# EAGLE design W020B (EAGLE 6.6.0)
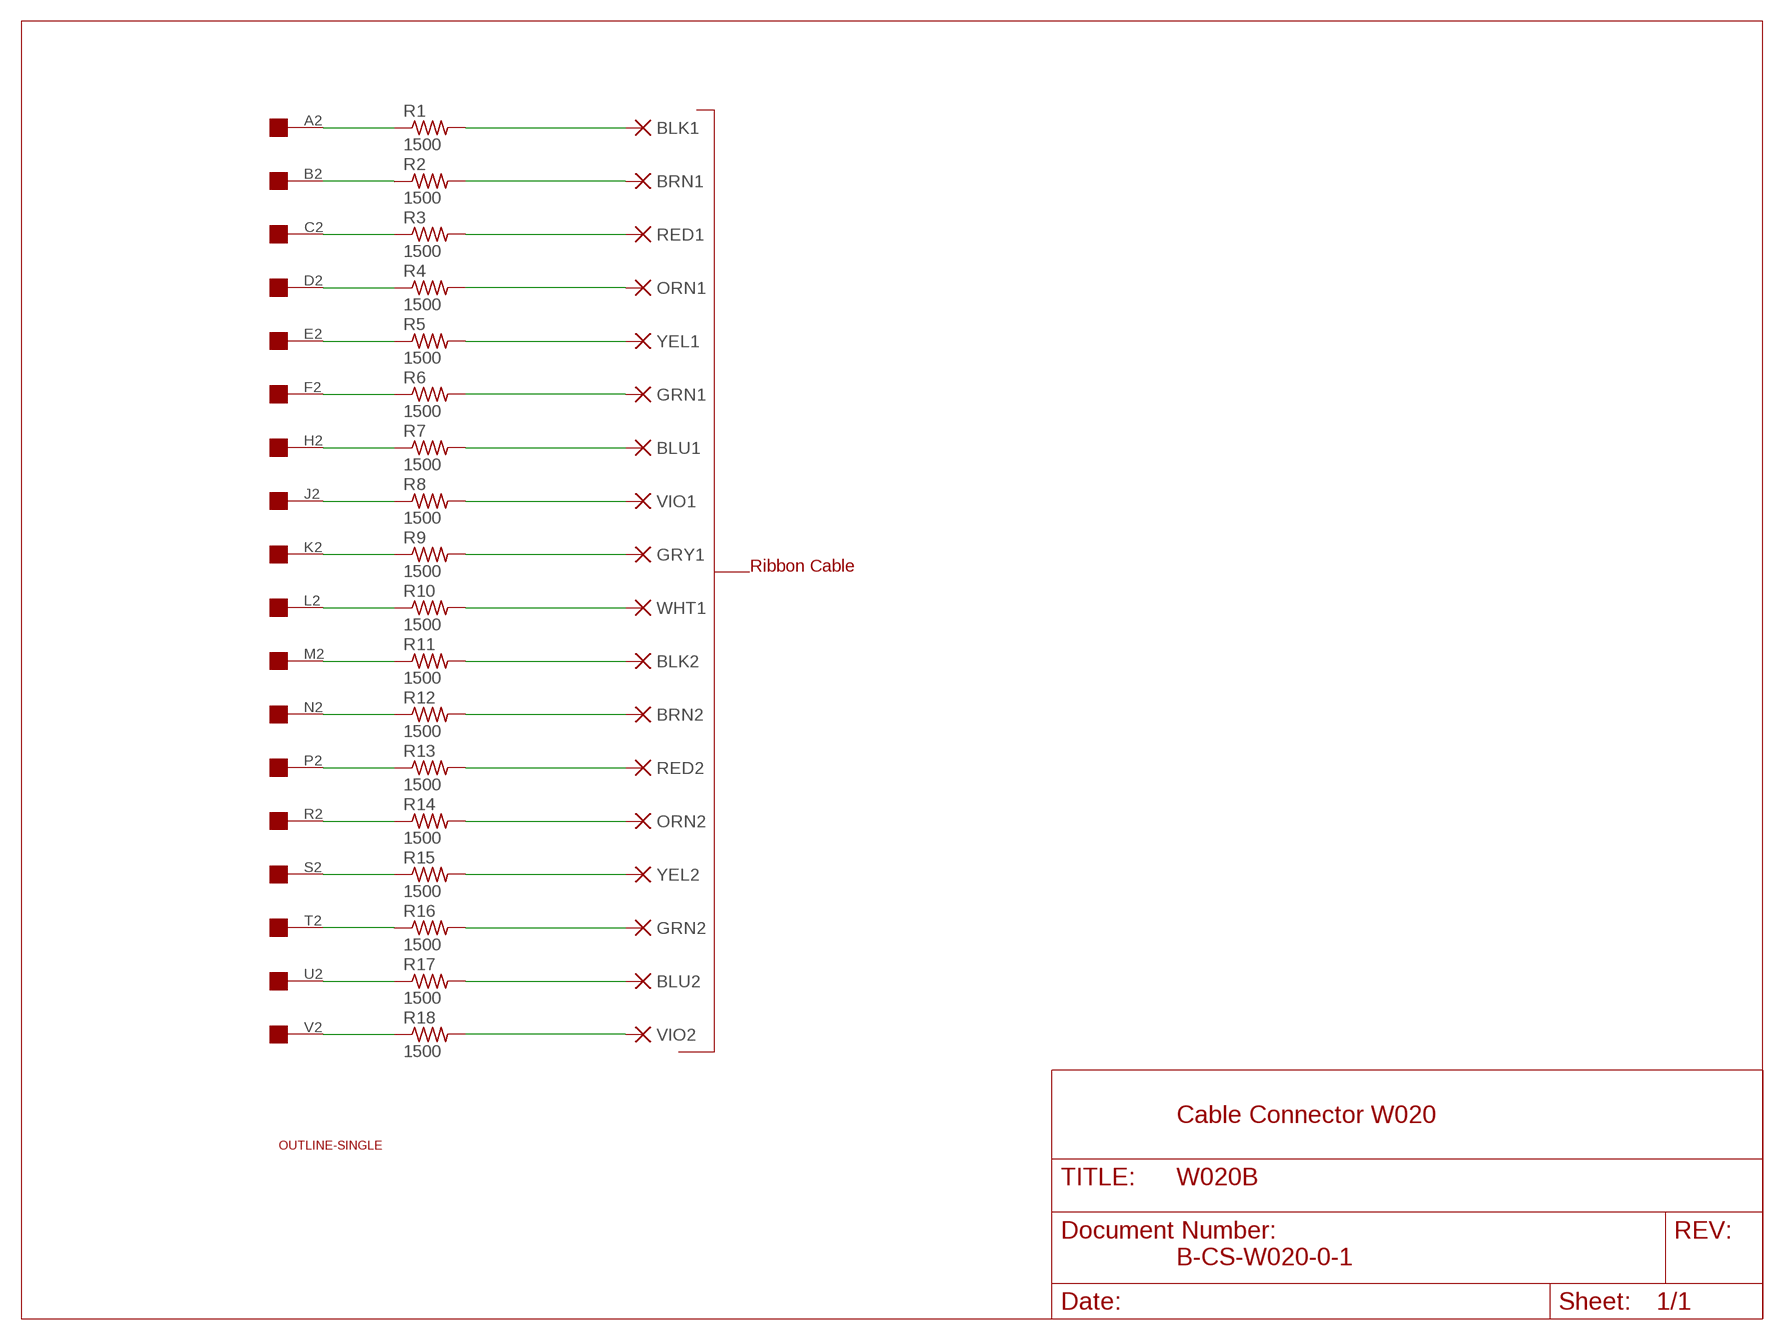
[diagram p0: schematic, sheet 1]

## Parts
BLK1  PAD-0465  [0465]
BLK2  PAD-0465  [0465]
BLU1  PAD-0465  [0465]
BLU2  PAD-0465  [0465]
BRN1  PAD-0465  [0465]
BRN2  PAD-0465  [0465]
GRN1  PAD-0465  [0465]
GRN2  PAD-0465  [0465]
GRY1  PAD-0465  [0465]
ORN1  PAD-0465  [0465]
ORN2  PAD-0465  [0465]
R1  1500  R-US_0207/10  [0207/10]
R2  1500  R-US_0207/10  [0207/10]
R3  1500  R-US_0207/10  [0207/10]
R4  1500  R-US_0207/10  [0207/10]
R5  1500  R-US_0207/10  [0207/10]
R6  1500  R-US_0207/10  [0207/10]
R7  1500  R-US_0207/10  [0207/10]
R8  1500  R-US_0207/10  [0207/10]
R9  1500  R-US_0207/10  [0207/10]
R10  1500  R-US_0207/10  [0207/10]
R11  1500  R-US_0207/10  [0207/10]
R12  1500  R-US_0207/10  [0207/10]
R13  1500  R-US_0207/10  [0207/10]
R14  1500  R-US_0207/10  [0207/10]
R15  1500  R-US_0207/10  [0207/10]
R16  1500  R-US_0207/10  [0207/10]
R17  1500  R-US_0207/10  [0207/10]
R18  1500  R-US_0207/10  [0207/10]
RED1  PAD-0465  [0465]
RED2  PAD-0465  [0465]
U$1  OUTLINE-SINGLE  [SINGLE]
U$2  EDGE-1  [EDGE-CON1]
VIO1  PAD-0465  [0465]
VIO2  PAD-0465  [0465]
WHT1  PAD-0465  [0465]
YEL1  PAD-0465  [0465]
YEL2  PAD-0465  [0465]

## Nets
A2: R1.1 U$2.A2
B2: R2.1 U$2.B2
C2: R3.1 U$2.C2
D2: R4.1 U$2.D2
E2: R5.1 U$2.E2
F2: R6.1 U$2.F2
H2: R7.1 U$2.H2
J2: R8.1 U$2.J2
K2: R9.1 U$2.K2
L2: R10.1 U$2.L2
M2: R11.1 U$2.M2
N2: R12.1 U$2.N2
N$1 [Supply]: ORN1.P$1(P) R4.2
N$2 [Supply]: GRN1.P$1(P) R6.2
N$3 [Supply]: R8.2 VIO1.P$1(P)
N$4 [Supply]: R10.2 WHT1.P$1(P)
N$5 [Supply]: BRN2.P$1(P) R12.2
N$6 [Supply]: ORN2.P$1(P) R14.2
N$7 [Supply]: GRN2.P$1(P) R16.2
N$8 [Supply]: R18.2 VIO2.P$1(P)
N$9: BRN1.P$1(P) R2.2
N$10 [Supply]: R5.2 YEL1.P$1(P)
N$11: BLK1.P$1(P) R1.2
N$12: R3.2 RED1.P$1(P)
N$13: BLU1.P$1(P) R7.2
N$14: GRY1.P$1(P) R9.2
N$15: R13.2 RED2.P$1(P)
N$16: R15.2 YEL2.P$1(P)
N$17: BLU2.P$1(P) R17.2
N$18: BLK2.P$1(P) R11.2
P2: R13.1 U$2.P2
R2: R14.1 U$2.R2
S2: R15.1 U$2.S2
T2: R16.1 U$2.T2
U2: R17.1 U$2.U2
V2: R18.1 U$2.V2

## Notes on the sheet
- Ribbon Cable
- Cable Connector W020
- B-CS-W020-0-1

## Library data of the parts
BLK1 BLK2 BLU1 BLU2 BRN1 BRN2 GRN1 GRN2 GRY1 ORN1 ORN2 RED1 RED2 VIO1 VIO2 WHT1 YEL1 YEL2 = dec-con:PAD: WIRE PAD Standard US Drill Sizes
R1-R18 = rcl:R-US_: RESISTOR, American symbol
U$1 = dec-con:OUTLINE-*: Board outlines for DEC boards.
U$2 = dec-con:EDGE-1: Single-Sided DEC Edge Connector -- (side 2)

## Net classes
0 default: width 0.813 mm
1 Supply: width 0.813 mm

## Board
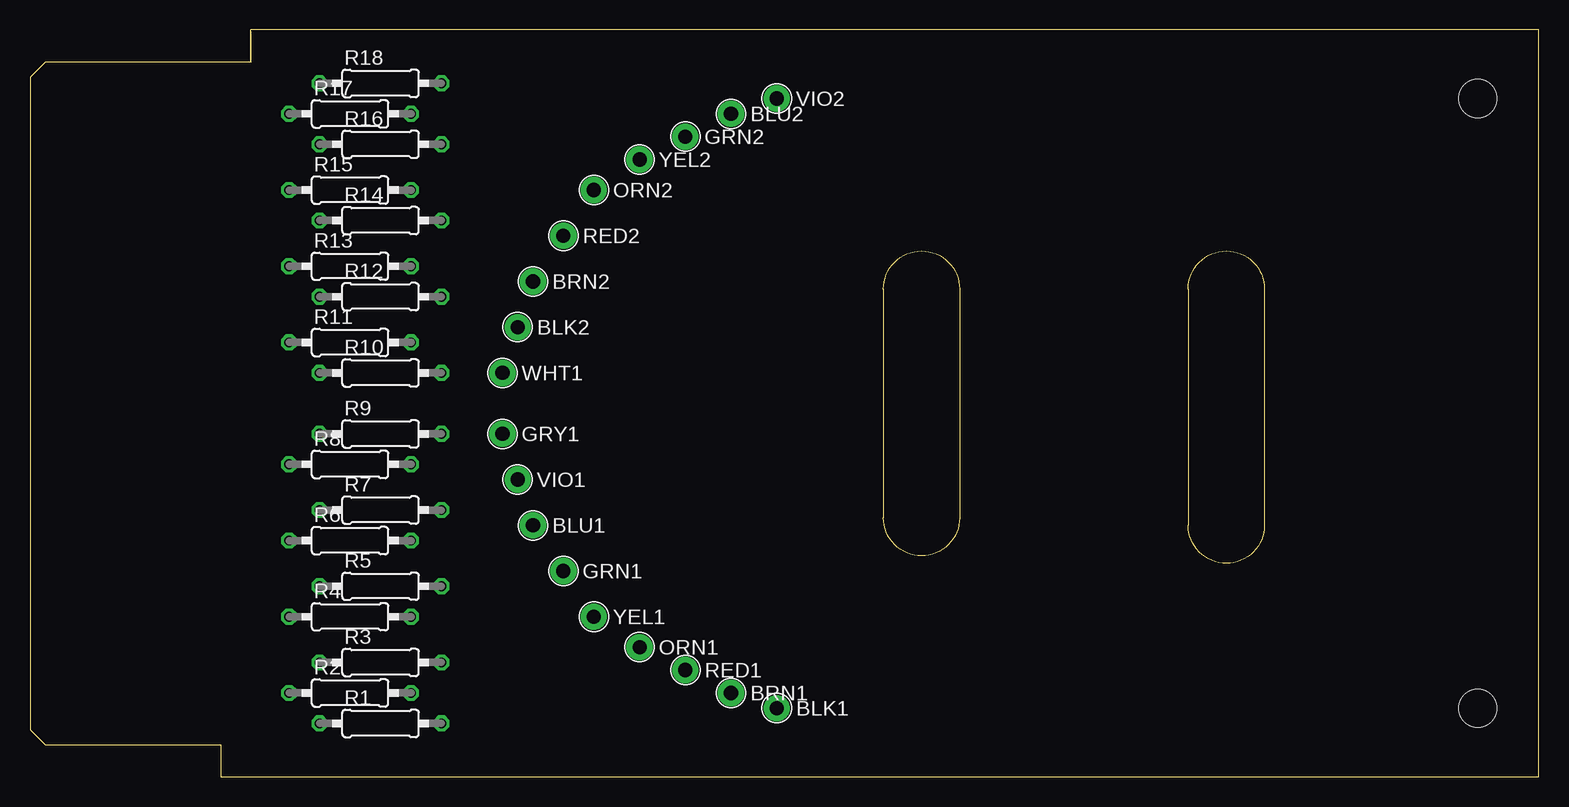
[diagram p1: board, top side]
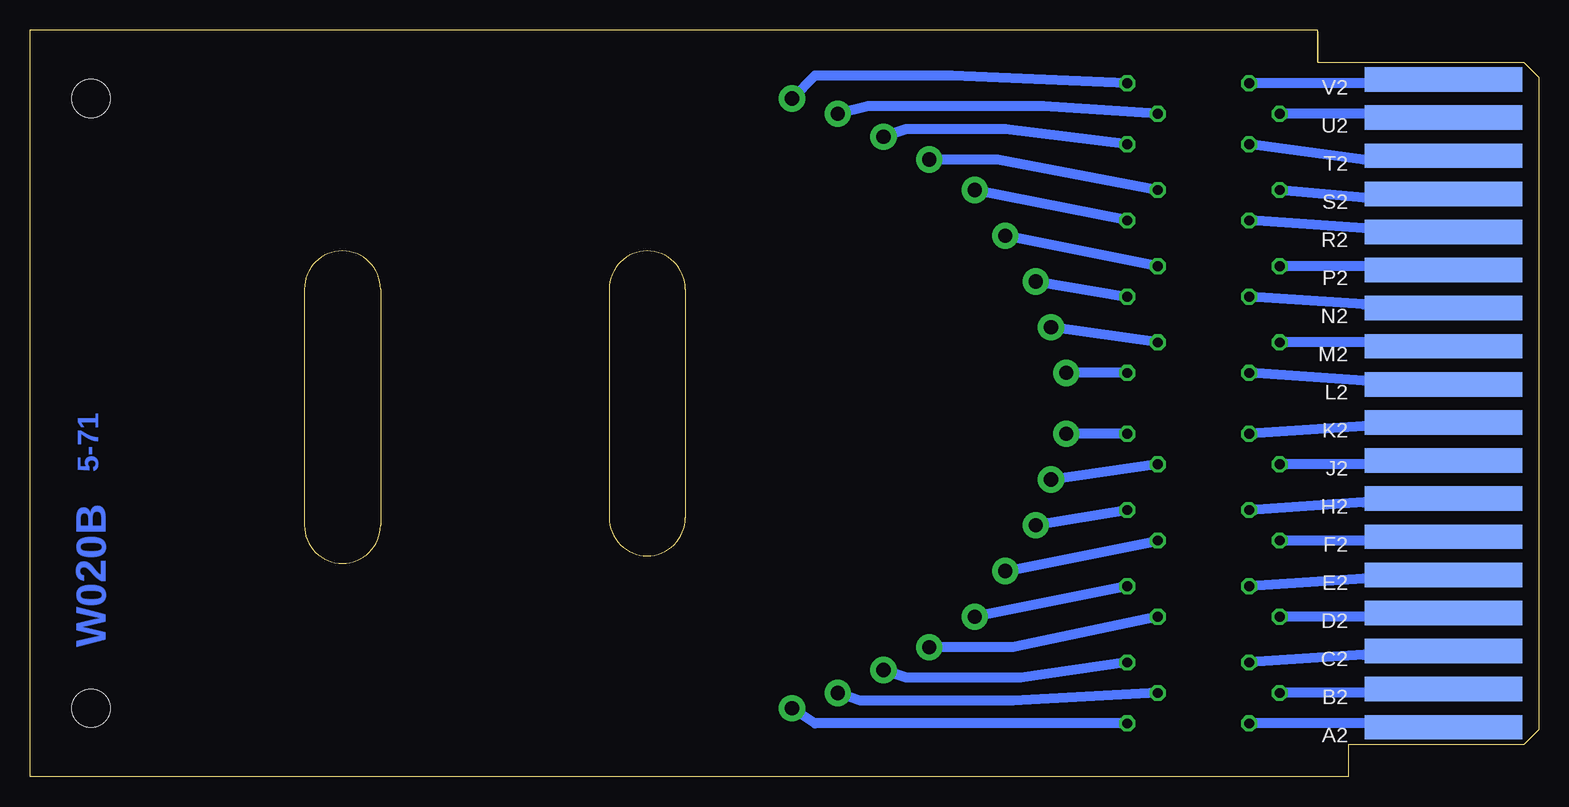
[diagram p2: board, bottom side, seen from below]

Size 125.73 x 62.23 mm. Coordinates in mm from the lower left corner, seen from the top.
Outline: 71.12,40.64 71.12,21.59 arc180 77.47,21.59 77.47,40.64 arc180 71.12,40.64
Outline: 96.52,40.64 96.52,20.95 arc180 102.87,20.95 102.87,40.64 arc180 96.52,40.64
Copper layers (1+16): Top 0.035mm / dielectric 1.5mm / Bottom 0.035mm
Design rules "16mils": minimum track width 16mil, minimum drill 32mil, track to track 15mil, track to pad 10mil, pad to pad 10mil, via to via 10mil, smd to smd 10mil, copper to edge 13mil, drill to drill 10mil, minimum pad ring 10mil, minimum via ring 8mil, stop-mask expansion 0mil, vias tented up to drill 0mil, thermal gap 10mil

### Footprints (pad centres in the part's own frame; a part is rotated, then mirrored left to right if it is on the bottom)
0465 = drill 1.181 pad 2.184: P$1 0,0
0207/10 = drill 0.813 octagon: 1 -5.08,0; 2 5.08,0
SINGLE = hole 3.175: 120.65,56.515; 120.65,5.715
EDGE-CON1 = smd 13.106 x 2.032 bottom: A2 7.938,4.128; B2 7.938,7.303; C2 7.938,10.477; D2 7.938,13.652; E2 7.938,16.828; F2 7.938,20.003; H2 7.938,23.177; J2 7.938,26.352; K2 7.938,29.527; L2 7.938,32.703; M2 7.938,35.877; N2 7.938,39.053; P2 7.938,42.227; R2 7.938,45.403; S2 7.938,48.578; T2 7.938,51.752; U2 7.938,54.928; V2 7.938,58.102

### Placement (x,y rotation side)
BLK1  62.23,5.71 0 top
BLK2  40.64,37.47 0 top
BLU1  41.91,20.95 0 top
BLU2  58.42,55.24 0 top
BRN1  58.42,6.99 0 top
BRN2  41.91,41.27 0 top
GRN1  44.45,17.14 0 top
GRN2  54.61,53.34 0 top
GRY1  39.37,28.57 0 top
ORN1  50.8,10.79 0 top
ORN2  46.99,48.9 0 top
R1  29.21,4.45 0 top
R2  26.67,6.99 0 top
R3  29.21,9.53 0 top
R4  26.67,13.34 0 top
R5  29.21,15.88 0 top
R6  26.67,19.68 0 top
R7  29.21,22.23 0 top
R8  26.67,26.04 0 top
R9  29.21,28.57 0 top
R10  29.21,33.66 0 top
R11  26.67,36.2 0 top
R12  29.21,40.01 0 top
R13  26.67,42.55 0 top
R14  29.21,46.35 0 top
R15  26.67,48.9 0 top
R16  29.21,52.7 0 top
R17  26.67,55.24 0 top
R18  29.21,57.78 0 top
RED1  54.61,8.89 0 top
RED2  44.45,45.09 0 top
U$1  0,0 0 top
U$2  0,0 0 top
VIO1  40.64,24.77 0 top
VIO2  62.23,56.52 0 top
WHT1  39.37,33.66 0 top
YEL1  46.99,13.34 0 top
YEL2  50.8,51.44 0 top

### Tracks (layer width: path | path; a pad name or v marks a point on that pad's centre or on a via)
A2
  Bottom 0.813: U$2.A2 8.26,4.13 8.26,4.45 R1.1
B2
  Bottom 0.813: U$2.B2 8.26,7.3 8.26,6.99 R2.1
C2
  Bottom 0.813: U$2.C2 8.89,10.48 8.89,10.16 13.97,10.16 14.61,10.16 R3.1
D2
  Bottom 0.813: U$2.D2 8.89,13.34 R4.1
E2
  Bottom 0.813: U$2.E2 8.26,16.51 14.61,16.51 R5.1
F2
  Bottom 0.813: U$2.F2 8.26,19.68 R6.1
H2
  Bottom 0.813: U$2.H2 8.26,22.86 14.61,22.86 R7.1
J2
  Bottom 0.813: U$2.J2 8.26,26.04 R8.1
K2
  Bottom 0.813: U$2.K2 8.26,29.21 14.61,29.21 R9.1
L2
  Bottom 0.813: U$2.L2 8.26,33.02 14.61,33.02 R10.1
M2
  Bottom 0.813: U$2.M2 8.26,36.2 R11.1
N2
  Bottom 0.813: U$2.N2 8.26,39.37 14.61,39.37 R12.1
N$1
  Bottom 0.813: R4.2 43.82,10.79 ORN1.P$1
N$2
  Bottom 0.813: GRN1.P$1 R6.2
N$3
  Bottom 0.813: R8.2 VIO1.P$1
N$4
  Bottom 0.813: R10.2 WHT1.P$1
N$5
  Bottom 0.813: BRN2.P$1 R12.2
N$6
  Bottom 0.813: R14.2 ORN2.P$1
N$7
  Bottom 0.813: R16.2 44.45,53.98 52.71,53.98 GRN2.P$1
N$8
  Bottom 0.813: R18.2 48.9,58.42 60.33,58.42 VIO2.P$1
N$9
  Bottom 0.813: R2.2 43.82,6.35 56.52,6.35 BRN1.P$1
N$10
  Bottom 0.813: R5.2 YEL1.P$1
N$11
  Bottom 0.813: R1.2 60.33,4.45 BLK1.P$1
N$12
  Bottom 0.813: R3.2 43.18,8.26 52.71,8.26 RED1.P$1
N$13
  Bottom 0.813: R7.2 BLU1.P$1
N$14
  Bottom 0.813: R9.2 GRY1.P$1
N$15
  Bottom 0.813: R13.2 RED2.P$1
N$16
  Bottom 0.813: R15.2 45.09,51.44 YEL2.P$1
N$17
  Bottom 0.813: R17.2 41.28,55.88 55.88,55.88 BLU2.P$1
N$18
  Bottom 0.813: R11.2 BLK2.P$1
P2
  Bottom 0.813: U$2.P2 8.26,42.55 R13.1
R2
  Bottom 0.813: U$2.R2 8.26,45.72 14.61,45.72 R14.1
S2
  Bottom 0.813: U$2.S2 8.26,48.26 14.61,48.26 R15.1
T2
  Bottom 0.813: U$2.T2 8.89,51.44 14.61,51.44 R16.1
U2
  Bottom 0.813: U$2.U2 8.26,55.24 R17.1
V2
  Bottom 0.813: U$2.V2 8.89,57.78 R18.1

### Text on the board
Bottom: 5-71 | W020B
200bmp: C:/Users/Vince/Documents/eagle/projects/DEC/Wxxx/W020/W020Bbackfb.bmp